# Altium schematic sheet LEDPCB.SchDoc
size A3
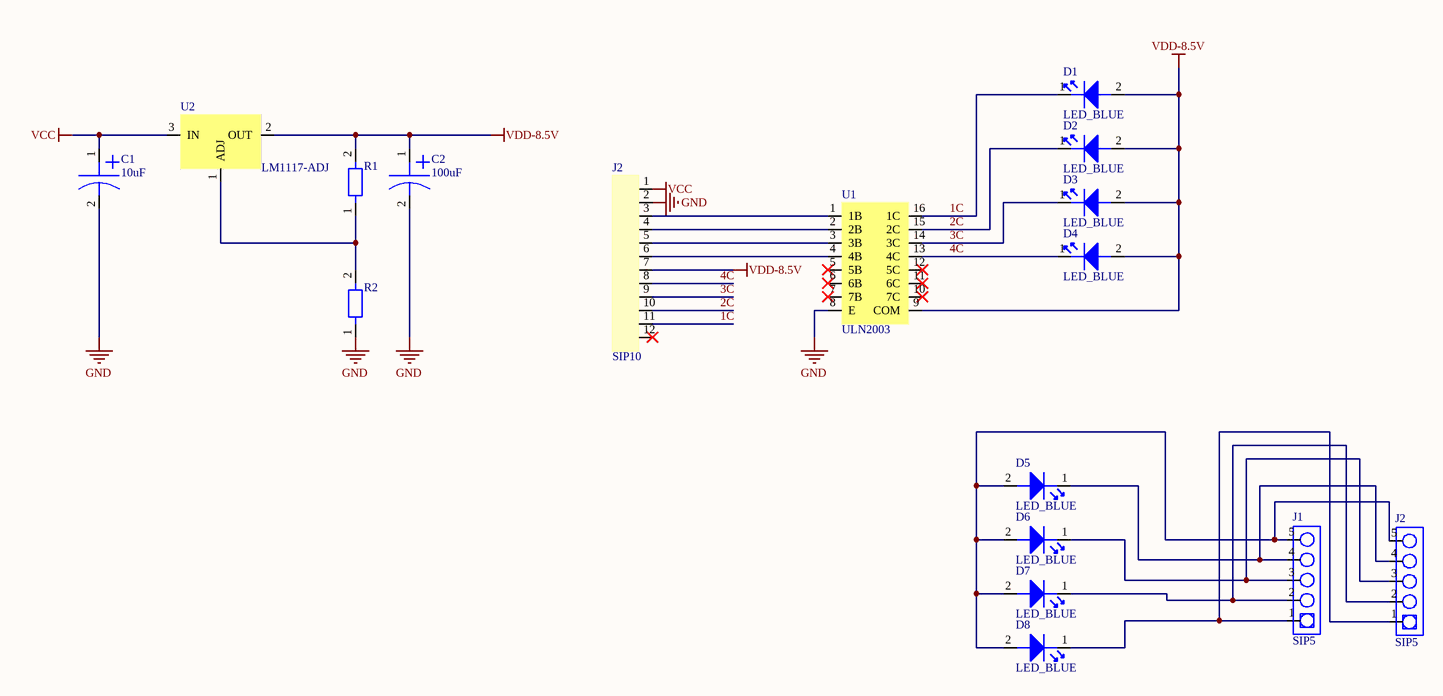
[diagram p0: LEDPCB.SchDoc]

## Parts
(Parts that share a designator on the sheet are numbered #1, #2 ... from top to bottom, then left to right.)
C1  10uF  [10uf/25v]
C2  100uF  [100uf/25v]
D1  LED_BLUE  [20MM LED灯]
D2  LED_BLUE  [20MM LED灯]
D3  LED_BLUE  [20MM LED灯]
D4  LED_BLUE  [20MM LED灯]
D5  LED_BLUE  [20MM LED灯]
D6  LED_BLUE  [20MM LED灯]
D7  LED_BLUE  [20MM LED灯]
D8  LED_BLUE  [20MM LED灯]
J1  SIP5  [SIP5]
J2#1  SIP10  [SIP12]
J2#2  SIP5  [SIP5]
R1  (no value)  [0603]
R2  (no value)  [0603]
U1  ULN2003  [ULN2003A]
U2  LM1117-ADJ  [LM1117]

## Nets
GND: C1.2 C2.2 J2#1.2 R2.1 U1.8(E)
VCC: C1.1 J2#1.1 U2.3(IN)
VDD-8.5V: C2.1 D1.2 D2.2 D3.2 D4.2 J2#1.7 R1.2 U1.9(COM) U2.2(OUT)
1C: D1.1 J2#1.11 U1.16(1C)
2C: D2.1 J2#1.10 U1.15(2C)
3C: D3.1 J2#1.9 U1.14(3C)
4C: D4.1 J2#1.8 U1.13(4C)
NetD5_1: D5.1 J1.4 J2#2.4
NetD5_2: D5.2 D6.2 D7.2 D8.2 J1.5 J2#2.5
NetD6_1: D6.1 J1.3 J2#2.3
NetD7_1: D7.1 J1.2 J2#2.2
NetD8_1: D8.1 J1.1 J2#2.1
NetJ2#1_3: J2#1.3 U1.1(1B)
NetJ2#1_4: J2#1.4 U1.2(2B)
NetJ2#1_5: J2#1.5 U1.3(3B)
NetJ2#1_6: J2#1.6 U1.4(4B)
NetR1_1: R1.1 R2.2 U2.1(ADJ)

Not connected (* = marked no-connect by the designer): J2#1 12*; U1 5(5B)* 6(6B)* 7(7B)* 10(7C)* 11(6C)* 12(5C)*

## Library data of the parts
C1 C2 = 极性电容
R1 R2 = R